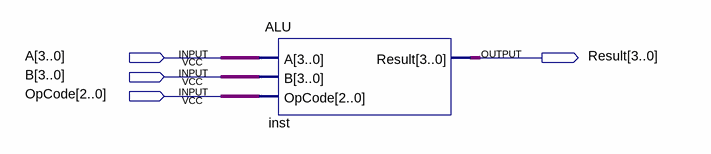
[diagram p0: schematic sheet]
// Quartus schematic ALUBlock.bdf as structural Verilog: 1 symbols, 4 pins
module ALUBlock (
  input  [3:0] A,
  input  [3:0] B,
  input  [2:0] OpCode,
  output [3:0] Result
);

  ALU inst (.A(A), .B(B), .OpCode(OpCode), .Result(Result));
endmodule
